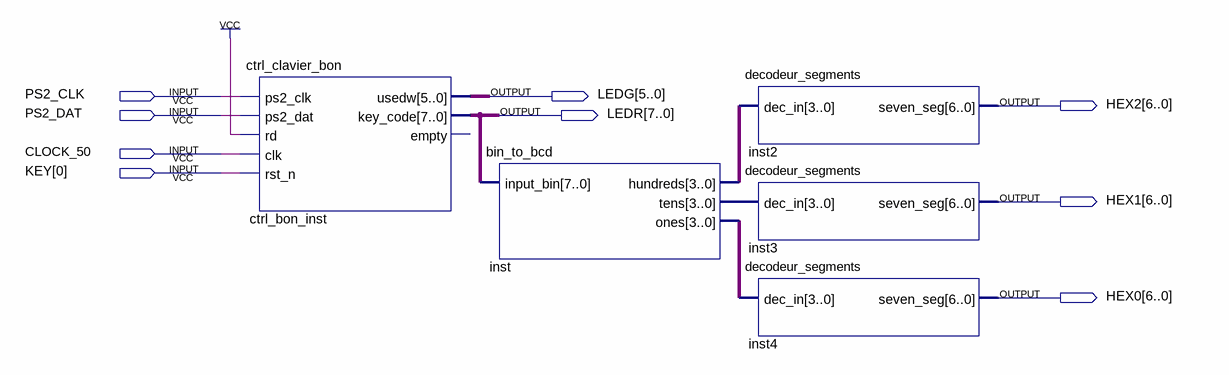
[diagram p0: schematic sheet]
// Quartus schematic partie3_top.bdf as structural Verilog: 5 symbols, 9 pins
module partie3_top (
  input  PS2_CLK,
  input  PS2_DAT,
  input  CLOCK_50,
  input  [0:0] KEY,
  output [5:0] LEDG,
  output [6:0] HEX2,
  output [7:0] LEDR,
  output [6:0] HEX1,
  output [6:0] HEX0
);

  wire [3:0] inst_hundreds, inst_ones, inst_tens;

  ctrl_clavier_bon ctrl_bon_inst (
    .ps2_clk(PS2_CLK), .ps2_dat(PS2_DAT), .rd(1'b1), .clk(CLOCK_50), .rst_n(KEY[0]), .usedw(LEDG),
    .key_code(LEDR));  // open: empty
  bin_to_bcd inst (.input_bin(LEDR), .hundreds(inst_hundreds), .tens(inst_tens), .ones(inst_ones));
  decodeur_segments inst2 (.dec_in(inst_hundreds), .seven_seg(HEX2));
  decodeur_segments inst3 (.dec_in(inst_tens), .seven_seg(HEX1));
  decodeur_segments inst4 (.dec_in(inst_ones), .seven_seg(HEX0));
endmodule
